# EAGLE design gbg_base_revb (EAGLE 9.1.3)
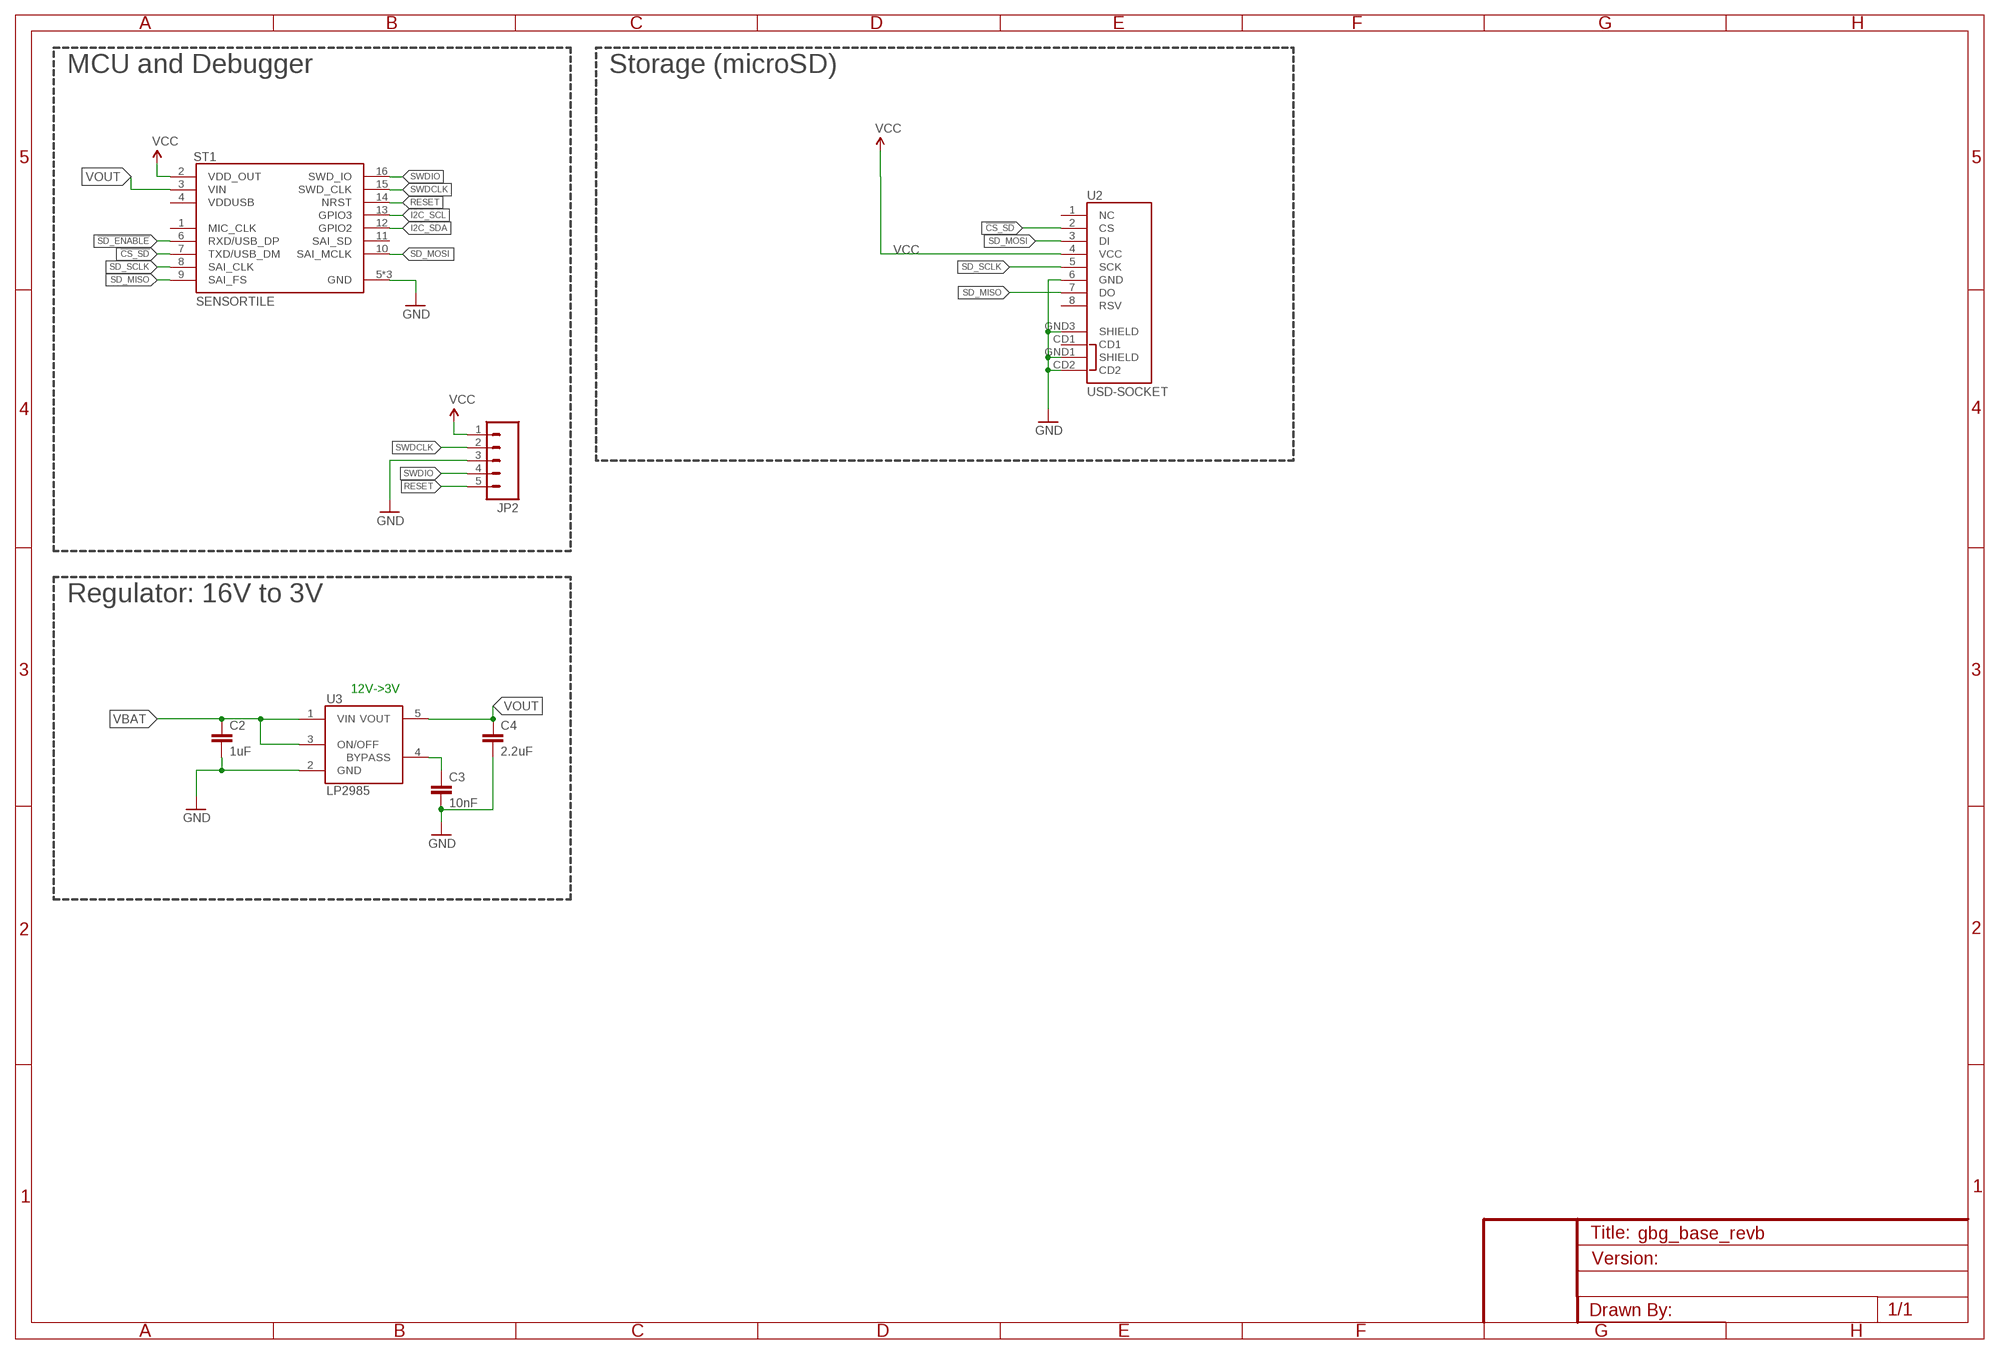
[diagram p0: schematic, sheet 1]

## Parts
C2  1uF  C-EU0603  [0603]
C3  10nF  C-EU0603  [0603]
C4  2.2uF  C-EU0603  [0603]
JP2  M05LOCK  [1X05_LOCK]
ST1  SENSORTILE  [SENSORTILE]
U2  USD-SOCKET  [MICROSD_1:1]
U3  LP2985AIM5-3.3  [SOT25]

## Nets
!CS_SD: ST1.7(TXD/USB_DM) U2.2(CS)
!SD_ENABLE: ST1.6(RXD/USB_DP)
BYPASS: C3.1 U3.4(BYPASS)
GND: C2.2 C3.2 C4.2 JP2.3 ST1.5(GND) ST1.17(GND) ST1.18(GND) U2.6(GND) U2.CD2 U2.GND1(SHIELD) U2.GND3(SHIELD) U3.2(GND)
I2C_SCL: ST1.13(GPIO3)
I2C_SDA: ST1.12(GPIO2)
RESET: JP2.5 ST1.14(NRST)
SD_MISO: ST1.9(SAI_FS) U2.7(DO)
SD_MOSI: ST1.10(SAI_MCLK) U2.3(DI)
SD_SCLK: ST1.8(SAI_CLK) U2.5(SCK)
SWDCLK: JP2.2 ST1.15(SWD_CLK)
SWDIO: JP2.4 ST1.16(SWD_IO)
VBAT: C2.1 U3.1(VIN) U3.3(ON/OFF)
VCC: JP2.1 ST1.2(VDD_OUT) U2.4(VCC)
VOUT: C4.1 ST1.3(VIN) U3.5(VOUT)
Unconnected: ST1.1(MIC_CLK) ST1.4(VDDUSB) ST1.11(SAI_SD) U2.1(NC) U2.8(RSV) U2.CD1

## Notes on the sheet
- MCU and Debugger | Storage (microSD)
- Regulator: 16V to 3V
- 12V->3V

## Library data of the parts
C2-C4 = tiny_passives:C-EU
JP2 = SparkFun-Connectors:M05: Header 5 Standard 5-pin 0.1" header. Use with straight break away headers (SKU : PRT-00116), right angle break away headers (PRT-00553), swiss pins (PRT-00743), machine pins (PRT-00117), and female headers (PRT-00115). Molex polarized connector foot print use with SKU : PRT-08230 with associated crimp pins and housings.
ST1 = sensortile:SENSORTILE
U2 = SparkFun-Connectors:USD-SOCKET: microSD Socket Push-push type uSD socket. Schematic element and footprint production proven. Spark Fun Electronics SKU : PRT-00127. tDoc lines correctly indicate media card edge positions when inserting (unlocked, locked, depressed). NOTE: CD1 and CD2 are connected internally; DIGIKEY: WM3290CT-ND; PROD_ID: CONN-07820
U3 = LP2985:LP2985: LP2985-N Micropower 150 mA Low-Noise Ultra Low-Dropout Regulator; DIGIKEY: 296-32152-1-ND; MPN: LP2985-30DBVR

## Net classes
0 default: width 0.33 mm, drill 0.33 mm, clearance 0.152 mm

## Board
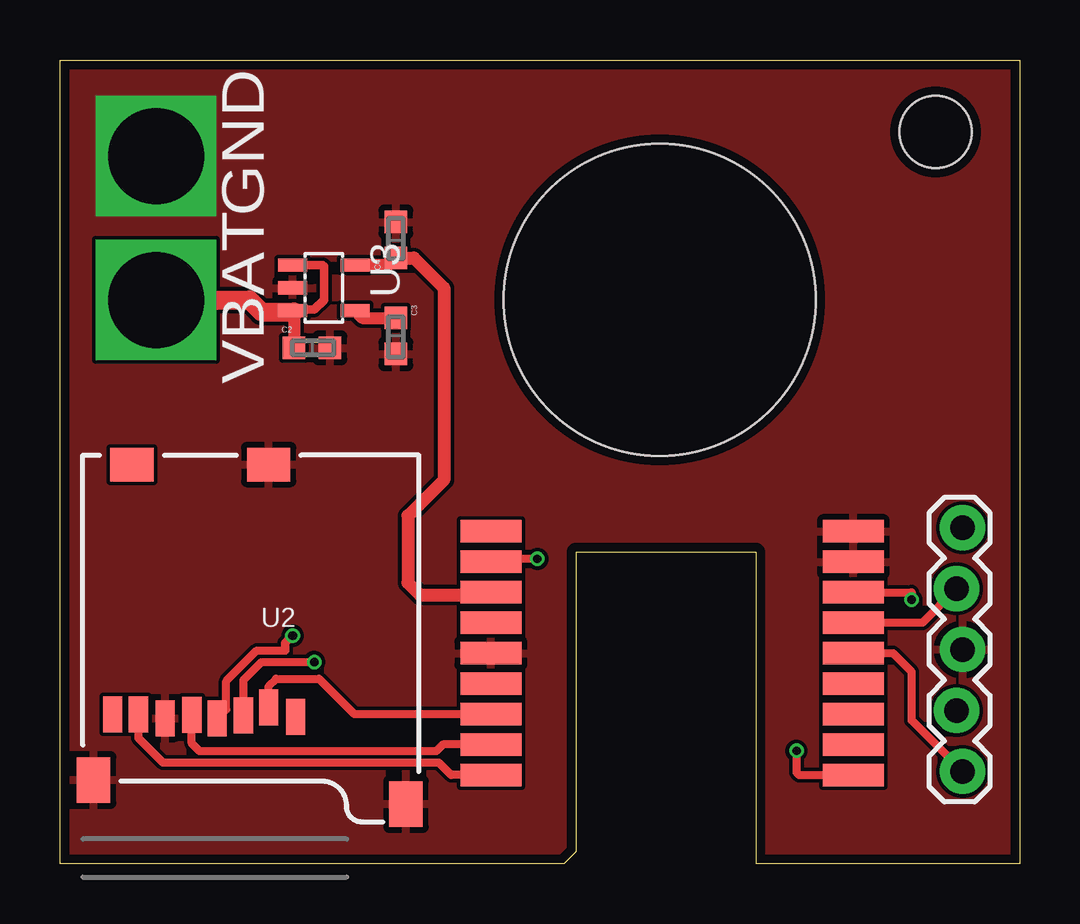
[diagram p1: board, top side]
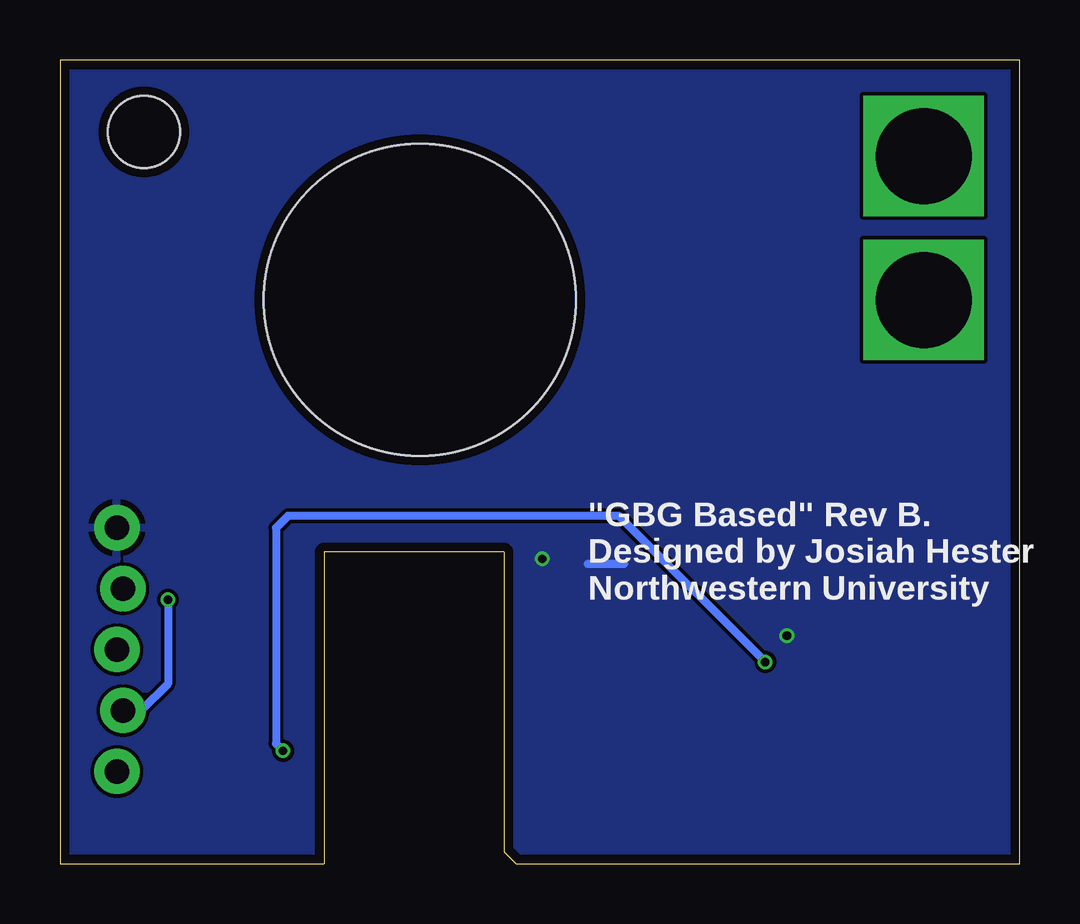
[diagram p2: board, bottom side, seen from below]

Size 40 x 33.5 mm. Coordinates in mm from the lower left corner, seen from the top.
Outline: 21.5,13 29,13 29,0 40,0 40,33.5 0,33.5 0,0 21,0 21.5,0.5 21.5,2 21.5,13
Copper layers (1*16): Top 0.035559375mm / dielectric 1.6mm / Bottom 0.035559375mm
Design rules "oshpark-2layer": minimum track width 6mil, minimum drill 10mil, track to track 6mil, track to pad 6mil, pad to pad 6mil, via to via 6mil, smd to smd 6mil, copper to edge 15mil, drill to drill 6mil, minimum pad ring 5mil, minimum via ring 5mil, stop-mask expansion 2.5mil, vias tented up to drill 0mil, thermal gap 10mil
Holes 3 mm at 36.5,30.5
Holes 13 mm at 25,23.5

### Footprints (pad centres in the part's own frame; a part is rotated, then mirrored left to right if it is on the bottom)
0603 = smd 0.95 x 0.95: 1 -0.75,0; 2 0.75,0
1X05_LOCK = drill 1.016 pad 1.88: 1 0,0.127; 2 2.54,-0.127; 3 5.08,0.127; 4 7.62,-0.127; 5 10.16,0.127
SENSORTILE = smd 2.54 x 0.94: 1 -2.54,6.35; 2 -2.54,5.08; 3 -2.54,3.81; 4 -2.54,2.54; 5 -2.54,1.27; 6 -2.54,0; 7 -2.54,-1.27; 8 -2.54,-2.54; 9 -2.54,-3.81; 10 12.573,-3.81; 11 12.573,-2.54; 12 12.573,-1.27; 13 12.573,0; 14 12.573,1.27; 15 12.573,2.54; 16 12.573,3.81; 17 12.573,5.08; 18 12.573,6.35
MICROSD_1:1 = smd 0.8 x 1.5: 1 5.096,10.919; 2 6.218,10.519; 3 7.274,10.853; 4 8.367,10.982; 5 9.421,10.828; 6 10.539,10.973; 7 11.648,10.819; 8 12.721,10.819 | smd 1.8 x 1.4: CD1 11.92,0.4; CD2 6.22,0.4 | smd 1.4 x 1.9: GND1 0.497,14.55; GND3 13.52,13.55
SOT25 = smd 0.55 x 1.2: 1 -0.95,-1.3; 2 0,-1.3; 3 0.95,-1.3; 4 0.95,1.3; 5 -0.95,1.3

### Placement (x,y rotation side)
C2  10.5,21.5 0 top
C3  14,22 270 top
C4  14,26 90 top
JP2  37.5,14 270 top
ST1  20.5,7.5 0 top
U2  14.92,17.03 180 top
U3  11,24 270 top

### Tracks (layer width: path | path; a pad name or v marks a point on that pad's centre or on a via)
!CS_SD
  Top 0.33: ST1.7 12.27,6.23 10.8,7.7 9,7.7 8.7,7.4 U2.2
BYPASS
  Top 0.5: U3.4 12.6,22.75 C3.1
GND  (via drill 4)
  other vias: 4,29.5
  pour Top: -7.5,-6.5 61.66,-6.5 61.66,33.56 -7.5,33.56
I2C_SDA
  Top 0.33: 33.34,6.5 33.5,6.5 33.23,6.23 ST1.12
RESET
  Top 0.33: JP2.5 35.5,5.97 35.5,8 34.73,8.77 ST1.14
SD_MISO
  Top 0.33: ST1.9 16.31,3.69 15.8,4.2 4.3,4.2 3.27,5.23 U2.7
SD_MOSI  (via drill 0.35)
  Top 0.33: U2.3 7.65,7.65 8.4,8.4 v10.6,8.4 | v30.7,4.7 30.7,3.8 30.81,3.69 ST1.10
  Bottom 0.33: v10.6,8.4 16.7,14.5 30.5,14.5 31,14 31,5 v30.7,4.7
SD_SCLK
  Top 0.33: 17.92,5 ST1.8 15.96,4.96 15.68,4.68 5.82,4.68 5.5,5 U2.5
SWDCLK
  Top 0.33: JP2.2 35.95,10.04 ST1.15
SWDIO  (via drill 0.35)
  Top 0.33: ST1.16 35.5,11.31 v35.5,11
  Bottom 0.33: JP2.4 36.62,6.38 35.5,7.5 v35.5,11
VBAT  (via drill 4)
  Top 0.35: U3.1 10.95,24.95 11,24.9 11,23.5 10.6,23.1 9.75,23.1 U3.3
  Top 0.5: U3.3 9.75,23 C2.1
  Top 0.8: v4,23.5 7.9,23.5 8.4,23 9.75,23
VCC  (via drill 0.35, 0.36)
  Top 0.33: v19.9,12.7 18.08,12.7 ST1.2 | U2.4 6.93,6.42 6.93,7.61 8.2,8.88 9.39,8.88 | 9.39,8.88
  Top 0.35: 9.39,8.88 9.39,9.19 v9.7,9.5
  Bottom 0.35: 16.5,12.5 18,12.5
  pour Bottom: -7.5,33.56 61.43,33.56 61.43,-6.5 -7.5,-6.5
VOUT
  Top 0.5: C4.1 13.7,24.95 U3.5
  Top 0.55: C4.1 14.75,25.25 16,24 16,16 14.5,14.5 14.5,11.7 15,11.2 17.85,11.2 ST1.3

### Text on the board
tPlace: GND | VBAT
bPlace: "GBG Based" Rev B. / Designed by Josiah Hester / Northwestern University